# Altium schematic sheet InputsConnectors.SchDoc
size Tabloid; Size: 11x17; Sheet_Name: InputsConnectors
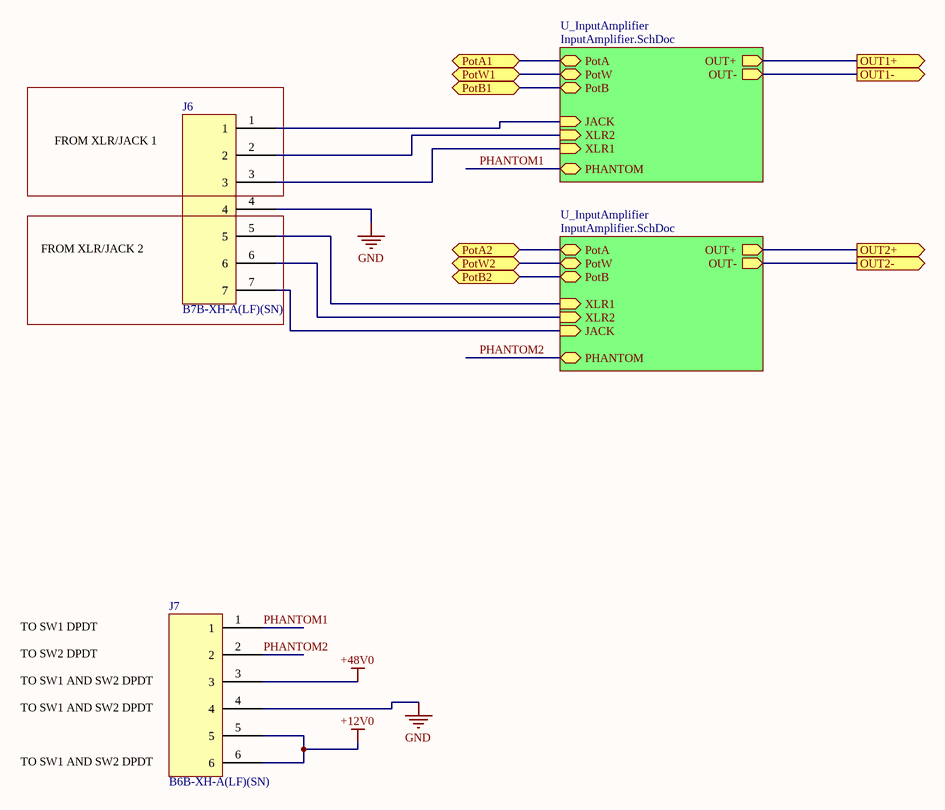
[diagram p0: InputsConnectors.SchDoc]

## Parts
J6  B7B-XH-A(LF)(SN)  [CONN_7_HEADER]
J7  Mfg_PN: B6B-XH-A(LF)(SN)  [CONN_6_HEADER]  (hidden comment: CON_XH_JST_6pins)

## Sub-sheets
U_InputAmplifier = InputAmplifier.SchDoc: OUT+ (out), OUT- (out), PotA (bidir), PotB (bidir), PotW (bidir), XLR1 (in), XLR2 (in), PHANTOM (bidir), JACK (in)
U_InputAmplifier = InputAmplifier.SchDoc: OUT+ (out), OUT- (out), PotA (bidir), PotB (bidir), PotW (bidir), XLR1 (in), XLR2 (in), PHANTOM (bidir), JACK (in)

## Ports
OUT1+ (out), OUT1- (out), OUT2+ (out), OUT2- (out), PotA1 (bidir), PotA2 (bidir), PotB1 (bidir), PotB2 (bidir), PotW1 (bidir), PotW2 (bidir)

## Nets
+12V0: J7.5 J7.6
+48V0: J7.3
GND: J6.4 J7.4
OUT1+: port OUT1+, sheet U_InputAmplifier/OUT+
OUT1-: port OUT1-, sheet U_InputAmplifier/OUT-
OUT2+: port OUT2+, sheet U_InputAmplifier/OUT+
OUT2-: port OUT2-, sheet U_InputAmplifier/OUT-
PHANTOM1: J7.1 ; sheet U_InputAmplifier/PHANTOM
PHANTOM2: J7.2 ; sheet U_InputAmplifier/PHANTOM
PotA1: port PotA1, sheet U_InputAmplifier/PotA
PotA2: port PotA2, sheet U_InputAmplifier/PotA
PotB1: port PotB1, sheet U_InputAmplifier/PotB
PotB2: port PotB2, sheet U_InputAmplifier/PotB
PotW1: port PotW1, sheet U_InputAmplifier/PotW
PotW2: port PotW2, sheet U_InputAmplifier/PotW
NetJ6_1: J6.1 ; sheet U_InputAmplifier/JACK
NetJ6_2: J6.2 ; sheet U_InputAmplifier/XLR2
NetJ6_3: J6.3 ; sheet U_InputAmplifier/XLR1
NetJ6_5: J6.5 ; sheet U_InputAmplifier/XLR1
NetJ6_6: J6.6 ; sheet U_InputAmplifier/XLR2
NetJ6_7: J6.7 ; sheet U_InputAmplifier/JACK

## Notes on the sheet
- FROM XLR/JACK 1
- FROM XLR/JACK 2
- TO SW1 DPDT
- TO SW2 DPDT
- TO SW1 AND SW2 DPDT
- Sheet Name
- Project Title
- Size
- Group
- Revision
- Date :
- Filename :
- Sheet
- Authors :
- of

## Library data of the parts
J6 = CON_XH_JST_7pins: Mfg: JST Sales America Inc.; Supplier1: Digikey; Mfg_PN: B7B-XH-A(LF)(SN)
J7 = CON_XH_JST_6pins: Mfg: JST Sales America Inc.; Supplier1: Digikey